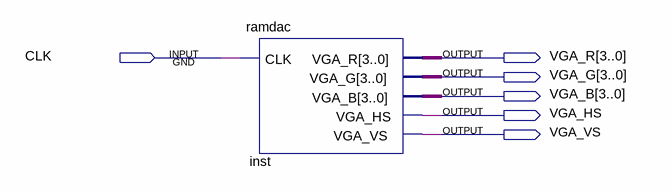
[diagram p0: schematic sheet]
// Quartus schematic per0.bdf as structural Verilog: 1 symbols, 6 pins
module per0 (
  input  CLK,
  output [3:0] VGA_R,
  output [3:0] VGA_G,
  output [3:0] VGA_B,
  output VGA_HS,
  output VGA_VS
);

  ramdac inst (.CLK(CLK), .VGA_R(VGA_R), .VGA_G(VGA_G), .VGA_B(VGA_B), .VGA_HS(VGA_HS), .VGA_VS(VGA_VS));
endmodule
